# Altium schematic sheet - RFID CARD READER SCHEMATIC.SchDoc
size A4; SheetNumber: 3; SheetTotal: 4; ENG_APP_DATE: --/--/--; DSN_APP_DATE: --/--/--; CHK_APP_DATE: --/--/--
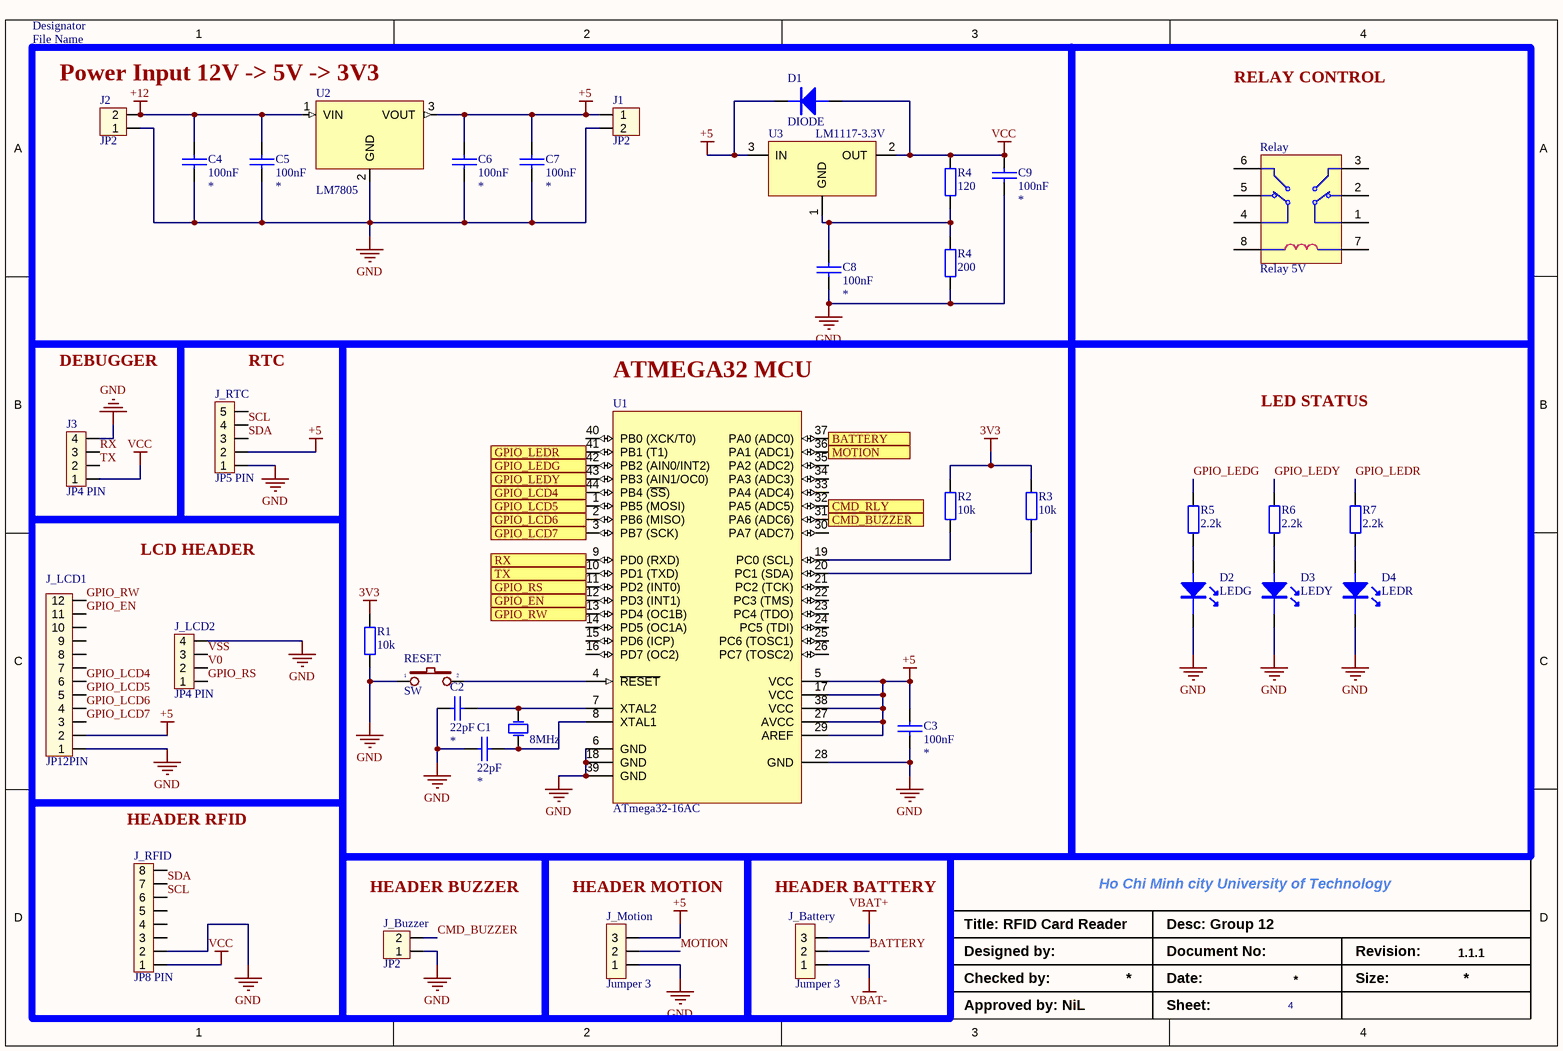
[diagram p0: - RFID CARD READER SCHEMATIC.SchDoc]

## Parts
(Parts that share a designator on the sheet are numbered #1, #2 ... from top to bottom, then left to right.)
C1  22pF  [R1206]
C2  22pF  [R1206]
C3  100nF  [R1206]
C4  100nF  [R1206]
C5  100nF  [R1206]
C6  100nF  [R1206]
C7  100nF  [R1206]
C8  100nF  [R1206]
C9  100nF  [R1206]
D1  DIODE  [diode]
D2  LEDG  [CAP10UF]
D3  LEDY  [CAP10UF]
D4  LEDR  [CAP10UF]
J1  JP2  [CON2]
J2  JP2  [CON2]
J3  JP4 PIN  [JP4]
J_Battery  Jumper 3  [JP3]
J_Buzzer  JP2  [CON2]
J_LCD1  JP12PIN  [JP12_1]
J_LCD2  JP4 PIN  [JP4]
J_Motion  Jumper 3  [JP3]
J_RFID  JP8 PIN  [JP8]
J_RTC  JP5 PIN  [JP5]
R1  10k  [R1/4W]
R2  10k  [R1/4W]
R3  10k  [R1/4W]
R4#1  120  [R1/4W]
R4#2  200  [R1/4W]
R5  2.2k  [R1/4W]
R6  2.2k  [R1/4W]
R7  2.2k  [R1/4W]
Relay  Relay 5V  [Relay 12V]
RESET  SW  [SW2]
U1  ATmega32-16AC  [44A_N]
U2  LM7805  [TO-220]
U3  LM1117-3.3V  [SOT223-4N]
Y?  8MHz  [XT2]

## Sub-sheets
Designator = ATMEGA32 MCU: no entries
Designator = File Name: no entries
Designator = DEBUGGER: no entries
Designator = RTC: no entries
Designator = LCD HEADER: no entries
Designator = HEADER RFID: no entries
Designator = LED STATUS: no entries
Designator = RELAY CONTROL: no entries
Designator = HEADER BUZZER: no entries
Designator = HEADER MOTION: no entries
Designator = HEADER BATTERY: no entries

## Ports
BATTERY (in), CMD_BUZZER (out), CMD_RLY (out), GPIO_EN (out), GPIO_LCD4 (out), GPIO_LCD5 (out), GPIO_LCD6 (out), GPIO_LCD7 (out), GPIO_LEDG (out), GPIO_LEDR (out), GPIO_LEDY (out), GPIO_RS (out), GPIO_RW (out), MOTION (in), RX (in), TX (out)

## Nets
3V3: R1.2 R2.2 R3.2
+5: C3.2 C6.2 C7.2 D1.2 J1.1 J_LCD1.2 J_Motion.3 J_RTC.2 U1.5(VCC) U1.17(VCC) U1.27(AVCC) U1.29(AREF) U1.38(VCC) U2.3(VOUT) U3.3(IN)
+12: C4.2 C5.2 J2.2 U2.1(VIN)
GND: C1.1 C2.1 C3.1 C4.1 C5.1 C6.1 C7.1 C8.1 C9.1 D2.2 D3.2 D4.2 J1.2 J2.1 J3.4 J_Buzzer.1 J_LCD1.1 J_LCD2.4 J_Motion.1 J_RFID.2 J_RTC.1 R1.1 R4#2.1 RESET.1 U1.6(GND) U1.18(GND) U1.28(GND) U1.39(GND) U2.2(GND)
VBAT+: J_Battery.3
VBAT-: J_Battery.1
VCC: C9.2 D1.1 J3.1 J_RFID.1 R4#1.2 U3.2(OUT)
BATTERY: U1.37(PA0_(ADC0)) ; port BATTERY
BATTERY: J_Battery.2  [a separate net that carries the same name]
CMD_BUZZER: U1.31(PA6_(ADC6)) ; port CMD_BUZZER
CMD_BUZZER: J_Buzzer.2  [a separate net that carries the same name]
CMD_RLY: U1.32(PA5_(ADC5)) ; port CMD_RLY
GPIO_EN: U1.12(PD3_(INT1)) ; port GPIO_EN
GPIO_EN: J_LCD1.11  [a separate net that carries the same name]
GPIO_LCD4: U1.44(PB4_(~{SS})) ; port GPIO_LCD4
GPIO_LCD4: J_LCD1.6  [a separate net that carries the same name]
GPIO_LCD5: U1.1(PB5_(MOSI)) ; port GPIO_LCD5
GPIO_LCD5: J_LCD1.5  [a separate net that carries the same name]
GPIO_LCD6: U1.2(PB6_(MISO)) ; port GPIO_LCD6
GPIO_LCD6: J_LCD1.4  [a separate net that carries the same name]
GPIO_LCD7: U1.3(PB7_(SCK)) ; port GPIO_LCD7
GPIO_LCD7: J_LCD1.3  [a separate net that carries the same name]
GPIO_LEDG: U1.42(PB2_(AIN0/INT2)) ; port GPIO_LEDG
GPIO_LEDG: R5.2  [a separate net that carries the same name]
GPIO_LEDR: U1.41(PB1_(T1)) ; port GPIO_LEDR
GPIO_LEDR: R7.2  [a separate net that carries the same name]
GPIO_LEDY: U1.43(PB3_(AIN1/OC0)) ; port GPIO_LEDY
GPIO_LEDY: R6.2  [a separate net that carries the same name]
GPIO_RS: U1.11(PD2_(INT0)) ; port GPIO_RS
GPIO_RS: J_LCD2.1  [a separate net that carries the same name]
GPIO_RW: U1.13(PD4_(OC1B)) ; port GPIO_RW
GPIO_RW: J_LCD1.12  [a separate net that carries the same name]
MOTION: U1.36(PA1_(ADC1)) ; port MOTION
MOTION: J_Motion.2  [a separate net that carries the same name]
RX: U1.9(PD0_(RXD)) ; port RX
RX: J3.3  [a separate net that carries the same name]
SCL: J_RFID.6 J_RTC.4
SDA: J_RFID.7 J_RTC.3
TX: U1.10(PD1_(TXD)) ; port TX
TX: J3.2  [a separate net that carries the same name]
V0: J_LCD2.2
VSS: J_LCD2.3
NetC1_2: C1.2 U1.8(XTAL1) Y?.2(OSC2)
NetC2_2: C2.2 U1.7(XTAL2) Y?.1(OSC1)
NetC8_2: C8.2 R4#1.1 R4#2.2 U3.1(GND)
NetD2_1: D2.1 R5.1
NetD3_1: D3.1 R6.1
NetD4_1: D4.1 R7.1
NetR2_1: R2.1 U1.19(PC0_(SCL))
NetR3_1: R3.1 U1.20(PC1_(SDA))
NetRESET_2: RESET.2 U1.4(~{RESET})

Not connected (* = marked no-connect by the designer): J_LCD1 7 8 9 10; J_RFID 3 4 5 8; J_RTC 5; Relay 1 2 3 4 5 6 7 8; U1 14(PD5_(OC1A)) 15(PD6_(ICP)) 16(PD7_(OC2)) 21(PC2_(TCK)) 22(PC3_(TMS)) 23(PC4_(TDO)) 24(PC5_(TDI)) 25(PC6_(TOSC1)) 26(PC7_(TOSC2)) 30(PA7_(ADC7)) 33(PA4_(ADC4)) 34(PA3_(ADC3)) 35(PA2_(ADC2)) 40(PB0_(XCK/T0))

## Notes on the sheet
- Power Input 12V -> 5V -> 3V3
- Title: RFID Card Reader
- Ho Chi Minh city University of Technology
- Desc: Group 12
- Designed by:
- Checked by:
- Approved by: NiL
- Date:
- Sheet:
- Document No:
- Revision:
- Size:
- 1.1.1

## Library data of the parts
C1-C9 = CAP: Capacitor; Footprint: *
D2-D4 = LED
J1 J2 J_Buzzer = CON2: Connector 2; Value: Connector 2
J3 J_LCD2 = JP4: Value: JP4
J_Battery J_Motion = JP3: Value: J3
J_LCD1 = JP12: JP12 PIN; Value: JP12
J_RFID = JP8: Value: JP7
J_RTC = JP5: Value: JP5
R1-R3 R4#1 R4#2 R5-R7 = R1/4W: Resistor 1/4W; Value: R1/4W - 1K
RESET = SW2: Switch button 2 pin; Value: SW chip 2 pin
U1 = ATmega32-16AC: 8-Bit AVR Microcontroller with 32K Bytes of In-System Programmable Flash Memory; Published: 17-Sep-2003; LatestRevisionDate: 13-Apr-2006; LatestRevisionNote: IPC-7351 Footprint Added.; DatasheetVersion: 2503C-AVR-10/02; PackageVersion: rev.B, Oct-2001; PackageReference: 44A; Publisher: Altium Limited; PackageDescription: 44-Pin Thin Quad Flat Pack 0.8 mm Pitch; ComponentLink1Description: Manufacturer Link; ComponentLink1URL: http://www.atmel.com; ComponentLink2Description: Datasheet; ComponentLink2URL: http://www.atmel.com/dyn/resources/prod_documents/doc2503.pdf
U2 = LM7805: TO-220; Text Field1: 70; Text Field2: 30
U3 = LM1117: 800mA Low-Dropout Linear Regulator; Creator: Nguyen Ba Bien; Website: http://group3i.net
Y? = Crystal: Crystal Oscillator; Published: 8-Jun-2000; LatestRevisionDate: 17-Jul-2002; LatestRevisionNote: Re-released for DXP Platform.; PackageReference: R38; Publisher: Altium Limited